# Altium schematic sheet [06] - eMMC, SPI NOR FLASH.SchDoc
size 513 x 386 mm
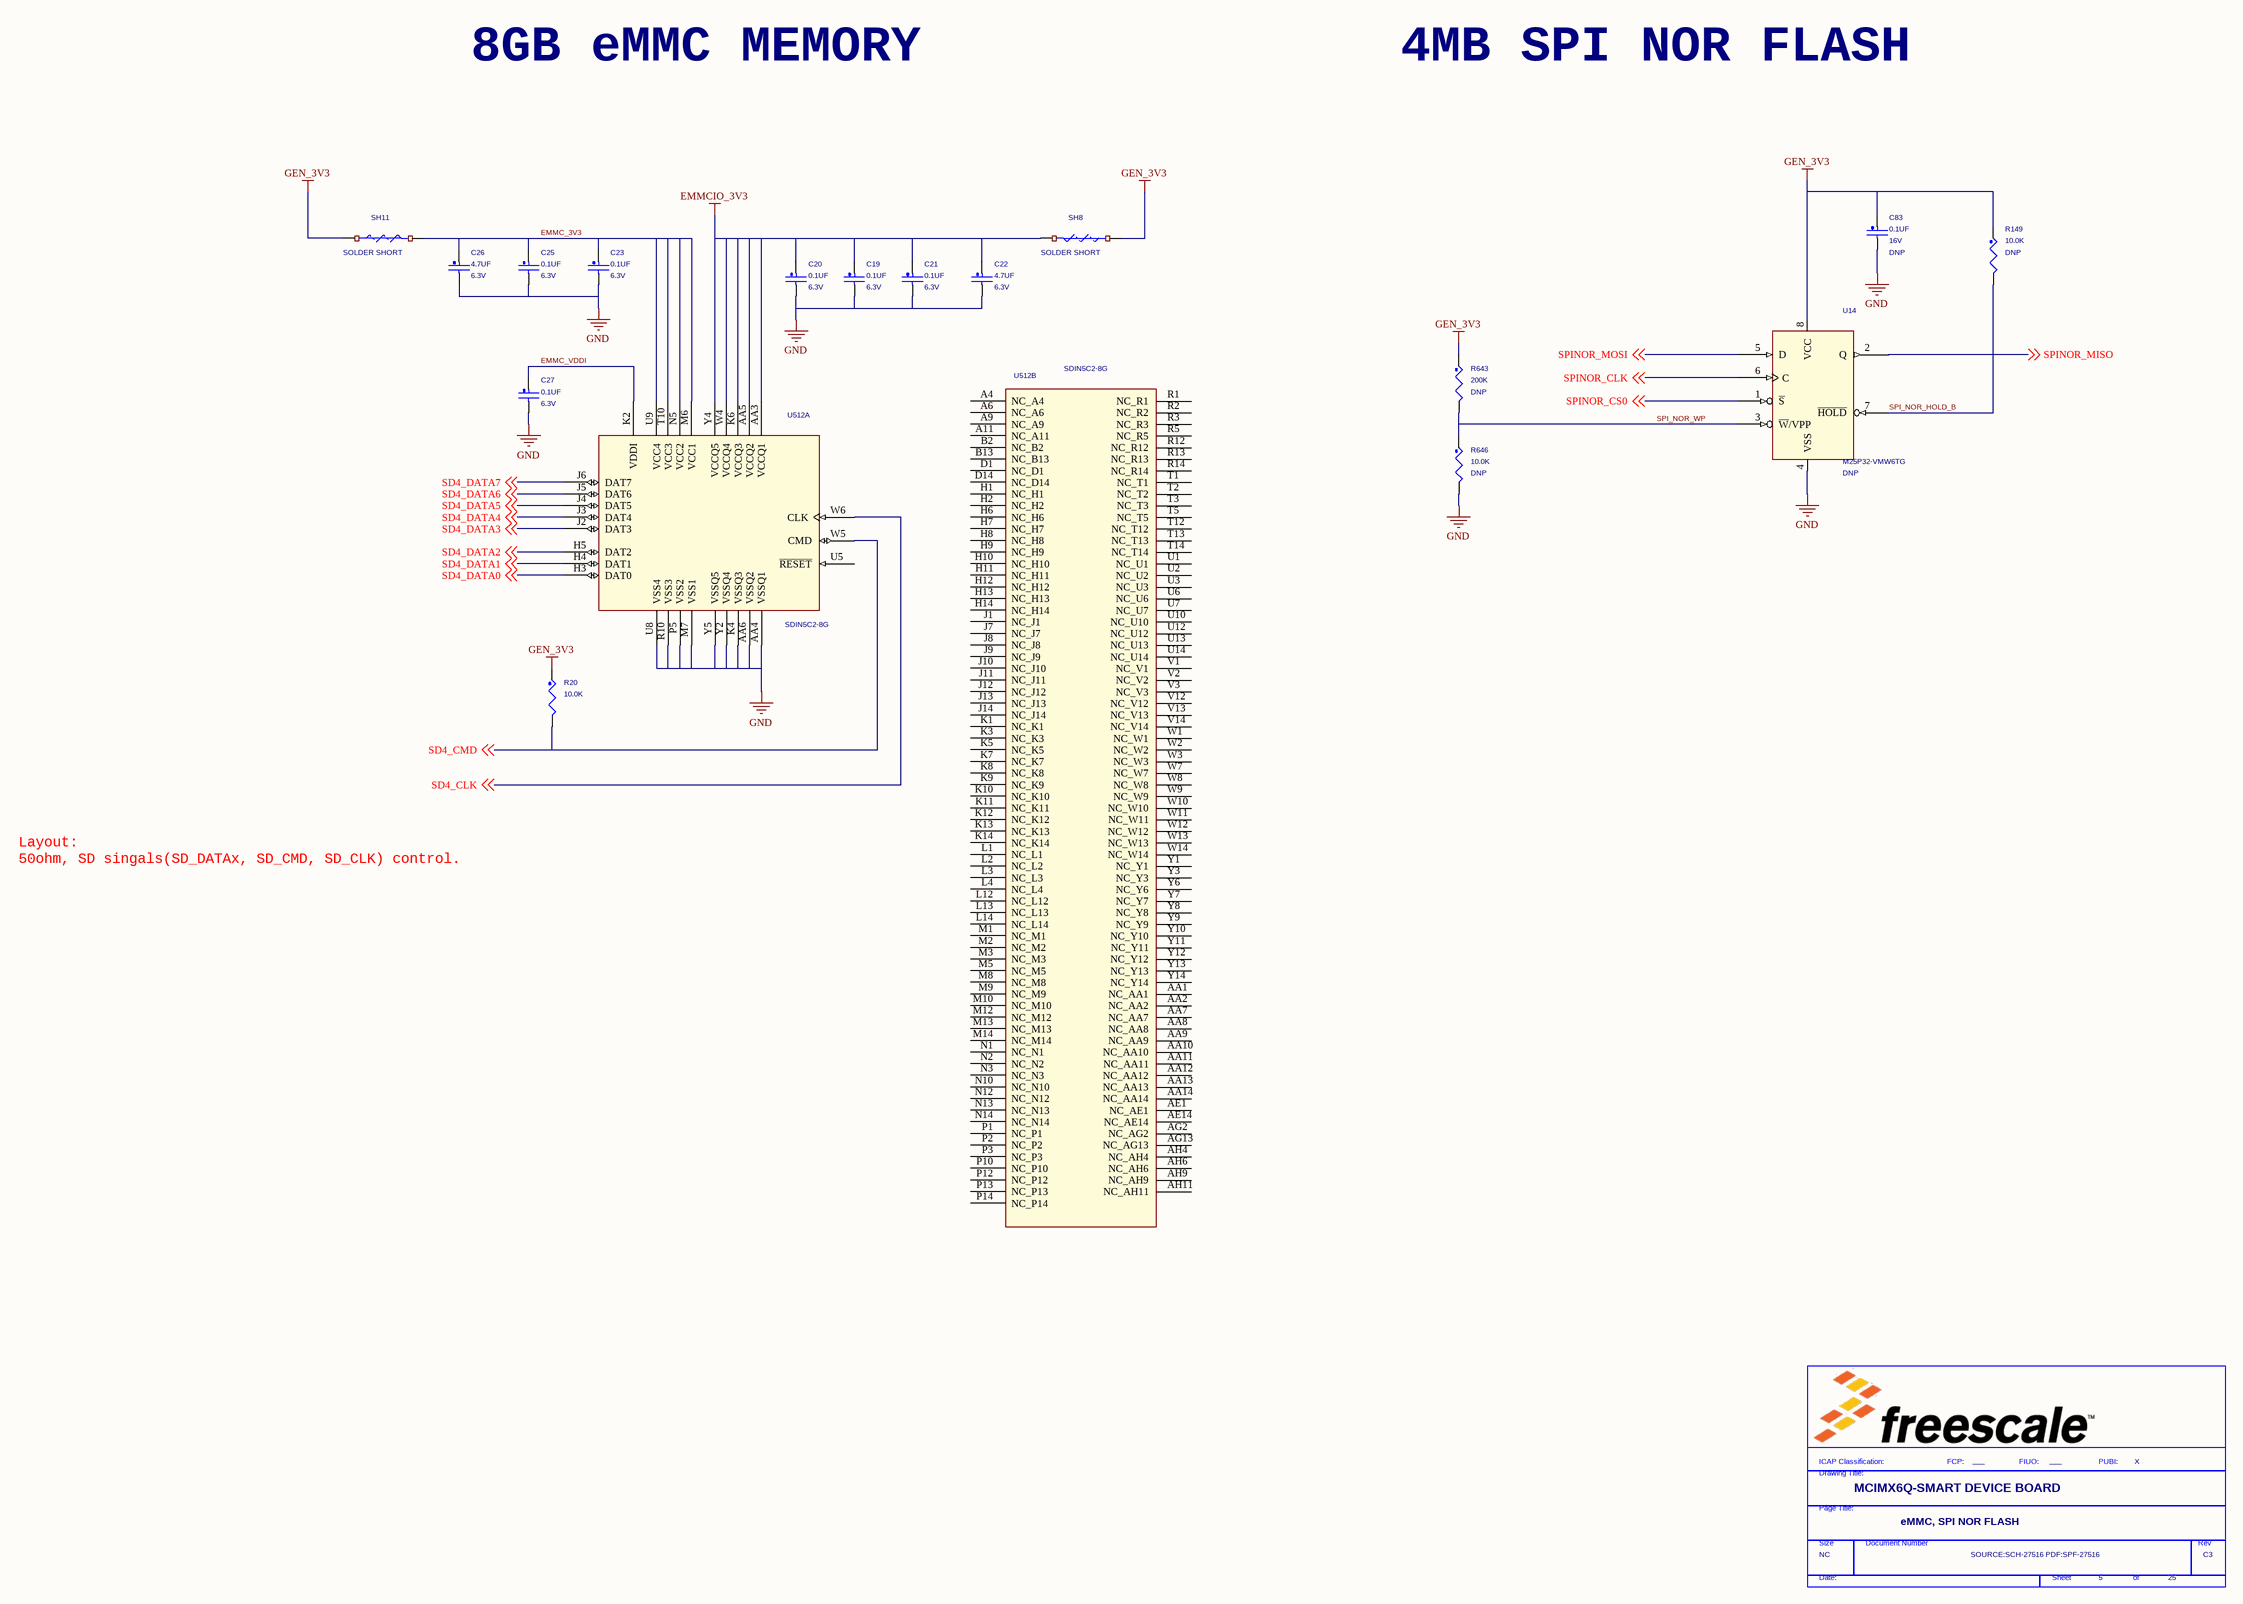
[diagram p0: [06] - eMMC, SPI NOR FLASH.SchDoc]

## Parts
*  FIUO: ___  PUBI: X  Doc: SOURCE:SCH-27516 PDF:SPF-27516  RevCode: C3  Title: MCIMX6Q-SMART DEVICE BOARD  Page Size: NC  Page Number: 5  Page Count: 25  PageTitle: eMMC, SPI NOR FLASH  (hidden comment: TitleBlock_FS)  (graphical)
C19  0.1UF  WVDC: 6.3V  [0201_CC]
C20  0.1UF  WVDC: 6.3V  [0201_CC]
C21  0.1UF  WVDC: 6.3V  [0201_CC]
C22  4.7UF  WVDC: 6.3V  [0603_CC]
C23  0.1UF  WVDC: 6.3V  [0201_CC]
C25  0.1UF  WVDC: 6.3V  [0201_CC]
C26  4.7UF  WVDC: 6.3V  [0603_CC]
C27  0.1UF  WVDC: 6.3V  [0201_CC]
C83  0.1UF  WVDC: 16V  ASSY_OPT: DNP  [0402_CC]
R20  10.0K  [0402_CC]
R149  10.0K  ASSY_OPT: DNP  [0402_CC]
R643  200K  ASSY_OPT: DNP  [0603_CC]
R646  10.0K  ASSY_OPT: DNP  [0402_CC]
SH8  SOLDER SHORT  [SH0805_40]
SH11  SOLDER SHORT  [SH0805_40]
U14  M25P32-VMW6TG  ASSY_OPT: DNP  [SO8WST]
U512  SDIN5C2-8G  [bga169_0p5_12x16]  (parts A,B of 2)

## Nets
EMMCIO_3V3: C19.1 C20.1 C21.1 C22.1 SH8.2 U512.AA3(VCCQ1) U512.AA5(VCCQ2) U512.K6(VCCQ3) U512.W4(VCCQ4) U512.Y4(VCCQ5)
GEN_3V3: C83.1 R20.1 R149.1 R643.1 SH8.1 SH11.1 U14.8(VCC)
GND: C19.2 C20.2 C21.2 C22.2 C23.2 C25.2 C26.2 C27.2 C83.2 R646.2 U14.4(VSS) U512.AA4(VSSQ1) U512.AA6(VSSQ2) U512.K4(VSSQ3) U512.M7(VSS1) U512.P5(VSS2) U512.R10(VSS3) U512.U8(VSS4) U512.Y2(VSSQ4) U512.Y5(VSSQ5)
EMMC_3V3: C23.1 C25.1 C26.1 SH11.2 U512.M6(VCC1) U512.N5(VCC2) U512.T10(VCC3) U512.U9(VCC4)
EMMC_VDDI: C27.1 U512.K2(VDDI)
SD4_CLK: U512.W6(CLK) ; off-sheet SD4_CLK
SD4_CMD: R20.2 U512.W5(CMD) ; off-sheet SD4_CMD
SD4_DATA0: U512.H3(DAT0) ; off-sheet SD4_DATA0
SD4_DATA1: U512.H4(DAT1) ; off-sheet SD4_DATA1
SD4_DATA2: U512.H5(DAT2) ; off-sheet SD4_DATA2
SD4_DATA3: U512.J2(DAT3) ; off-sheet SD4_DATA3
SD4_DATA4: U512.J3(DAT4) ; off-sheet SD4_DATA4
SD4_DATA5: U512.J4(DAT5) ; off-sheet SD4_DATA5
SD4_DATA6: U512.J5(DAT6) ; off-sheet SD4_DATA6
SD4_DATA7: U512.J6(DAT7) ; off-sheet SD4_DATA7
SPI_NOR_HOLD_B: R149.2 U14.7(~{HOLD})
SPI_NOR_WP: R643.2 R646.1 U14.3(~{W}/VPP)
SPINOR_CLK: U14.6(C) ; off-sheet SPINOR_CLK
SPINOR_CS0: U14.1(~{S}) ; off-sheet SPINOR_CS0
SPINOR_MISO: U14.2(Q) ; off-sheet SPINOR_MISO
SPINOR_MOSI: U14.5(D) ; off-sheet SPINOR_MOSI

Not connected (* = marked no-connect by the designer): U512 A4(NC_A4) A6(NC_A6) A9(NC_A9) A11(NC_A11) AA1(NC_AA1) AA2(NC_AA2) AA7(NC_AA7) AA8(NC_AA8) AA9(NC_AA9) AA10(NC_AA10) AA11(NC_AA11) AA12(NC_AA12) AA13(NC_AA13) AA14(NC_AA14) AE1(NC_AE1) AE14(NC_AE14) AG2(NC_AG2) AG13(NC_AG13) AH4(NC_AH4) AH6(NC_AH6) AH9(NC_AH9) AH11(NC_AH11) B2(NC_B2) B13(NC_B13) D1(NC_D1) D14(NC_D14) H1(NC_H1) H2(NC_H2) H6(NC_H6) H7(NC_H7) H8(NC_H8) H9(NC_H9) H10(NC_H10) H11(NC_H11) H12(NC_H12) H13(NC_H13) H14(NC_H14) J1(NC_J1) J7(NC_J7) J8(NC_J8) J9(NC_J9) J10(NC_J10) J11(NC_J11) J12(NC_J12) J13(NC_J13) J14(NC_J14) K1(NC_K1) K3(NC_K3) K5(NC_K5) K7(NC_K7) K8(NC_K8) K9(NC_K9) K10(NC_K10) K11(NC_K11) K12(NC_K12) K13(NC_K13) K14(NC_K14) L1(NC_L1) L2(NC_L2) L3(NC_L3) L4(NC_L4) L12(NC_L12) L13(NC_L13) L14(NC_L14) M1(NC_M1) M2(NC_M2) M3(NC_M3) M5(NC_M5) M8(NC_M8) M9(NC_M9) M10(NC_M10) M12(NC_M12) M13(NC_M13) M14(NC_M14) N1(NC_N1) N2(NC_N2) N3(NC_N3) N10(NC_N10) N12(NC_N12) N13(NC_N13) N14(NC_N14) P1(NC_P1) P2(NC_P2) P3(NC_P3) P10(NC_P10) P12(NC_P12) P13(NC_P13) P14(NC_P14) R1(NC_R1) R2(NC_R2) R3(NC_R3) R5(NC_R5) R12(NC_R12) R13(NC_R13) R14(NC_R14) T1(NC_T1) T2(NC_T2) T3(NC_T3) T5(NC_T5) T12(NC_T12) T13(NC_T13) T14(NC_T14) U1(NC_U1) U2(NC_U2) U3(NC_U3) U5(~{RESET}) U6(NC_U6) U7(NC_U7) U10(NC_U10) U12(NC_U12) U13(NC_U13) U14(NC_U14) V1(NC_V1) V2(NC_V2) V3(NC_V3) V12(NC_V12) V13(NC_V13) V14(NC_V14) W1(NC_W1) W2(NC_W2) W3(NC_W3) W7(NC_W7) W8(NC_W8) W9(NC_W9) W10(NC_W10) W11(NC_W11) W12(NC_W12) W13(NC_W13) W14(NC_W14) Y1(NC_Y1) Y3(NC_Y3) Y6(NC_Y6) Y7(NC_Y7) Y8(NC_Y8) Y9(NC_Y9) Y10(NC_Y10) Y11(NC_Y11) Y12(NC_Y12) Y13(NC_Y13) Y14(NC_Y14)

## Notes on the sheet
- 8GB eMMC MEMORY
- 4MB SPI NOR FLASH
- Layout:
  50ohm, SD singals(SD_DATAx, SD_CMD, SD_CLK) control.
- (in symbol TitleBlock_FS) ICAP Classification:; FCP:; FIUO:; PUBI:; Drawing Title:; Page Title:; Size; Document Number; Rev; Date:; Sheet; of

## Library data of the parts
* = TitleBlock_FS: OrgName: Freescale Semiconductor; OrgAddr1: 6501 William Cannon Drive West; OrgAddr2: Austin, TX 78735-8598; FCP: ___; Page Create Date: March  8, 1995
C19-C21 C25 = CAP_NP: CAP CER 0.1UF 6.3V 10% X5R 0201; CLASS: DISCRETE; FPLIST: CC0201,CC0201_HD,CC0201_3PIN,0201_CC; CAD_APPROVED: Yes; MFG_PN01: GRM033R60J104KE19D; MFG_NAME01: MURATA; AGILE_PN: 150-75429; SIGNAL_MODEL: DEFAULT_CAPACITOR_100000pF_2_1; VOLTAGE: 6.3V; HEIGHT: 0.33MM; ROHS: Yes; Tolerance: 10%
C22 = CAP_NP: CAP CER 4.7UF 6.3V 10% X5R 0603; CLASS: DISCRETE; AGILE_PN: 150-75487; MFG_NAME01: VENKEL COMPANY; MFG_PN01: C0603X5R6R3-475KNP; CAD_APPROVED: Yes; FPLIST: CC0603_OV,CC0603,0603_CC; SIGNAL_MODEL: DEFAULT_CAPACITOR_4.7e+06pF_2_1; VOLTAGE: 6.3V; Tolerance: 10%; ROHS: Yes; HEIGHT: 1.016MM
C23 C27 = CAP_NP: CAP CER 0.1UF 6.3V 10% X5R 0201; CLASS: DISCRETE; AGILE_PN: 150-75429; MFG_NAME01: MURATA; MFG_PN01: GRM033R60J104KE19D; CAD_APPROVED: Yes; FPLIST: CC0201,CC0201_HD,CC0201_3PIN,0201_CC; SIGNAL_MODEL: DEFAULT_CAPACITOR_100000pF_2_1; VOLTAGE: 6.3V; Tolerance: 10%; ROHS: Yes; HEIGHT: 0.33MM
C26 = CAP_NP: CAP CER 4.7UF 6.3V 10% X5R 0603; CLASS: DISCRETE; FPLIST: CC0603_OV,CC0603,0603_CC; CAD_APPROVED: Yes; MFG_PN01: C0603X5R6R3-475KNP; MFG_NAME01: VENKEL COMPANY; AGILE_PN: 150-75487; SIGNAL_MODEL: DEFAULT_CAPACITOR_4.7e+06pF_2_1; VOLTAGE: 6.3V; HEIGHT: 1.016MM; ROHS: Yes; Tolerance: 10%
C83 = CAP_NP: CAP CER 0.1UF 16V 10% X7R 0402; CLASS: DISCRETE; FPLIST: CC0402_25,CC0402_HD,0402_CC; CAD_APPROVED: Yes; MFG_PN01: C0402C104K4RAC; MFG_NAME01: KEMET; AGILE_PN: 150-75182; SIGNAL_MODEL: DEFAULT_CAPACITOR_100000pF_2_1; VOLTAGE: 16V; HEIGHT: 0.635MM; ROHS: Yes; Tolerance: 10%
R20 R149 = RES: RES MF 10.0K 1/16W 1% 0402; CLASS: DISCRETE; FPLIST: RC0402_25,RC0402_HD,0402_CC; CAD_APPROVED: Yes; MFG_PN01: CRCW040210K0FKED; MFG_NAME01: VISHAY INTERTECHNOLOGY; AGILE_PN: 470-75416; SIGNAL_MODEL: DEFAULT_RESISTOR_10000OHM_2_1; ROHS: Yes; Tolerance: 1%
R643 = RES: RES MF 200K 1/10W 1% 0603; CLASS: DISCRETE; FPLIST: RC0603_OV,RC0603,0603_CC; CAD_APPROVED: Yes; MFG_PN01: RK73H1JTTD2003F; MFG_NAME01: KOA SPEER; AGILE_PN: 470-76381; ROHS: Yes; Tolerance: 1%
R646 = RES: RES MF 10.0K 1/16W 1% 0402; CLASS: DISCRETE; AGILE_PN: 470-75416; MFG_NAME01: VISHAY INTERTECHNOLOGY; MFG_PN01: CRCW040210K0FKED; CAD_APPROVED: Yes; FPLIST: RC0402_25,RC0402_HD,0402_CC; SIGNAL_MODEL: DEFAULT_RESISTOR_10000OHM_2_1; Tolerance: 1%; ROHS: Yes
SH8 SH11 = RES_SHORT-2: SOLDER SHORT 0805  SMT NO PART TO ORDER; CLASS: DISCRETE; FPLIST: SH0805,SH0805CUST,SH0805_40; CAD_APPROVED: Yes; ASSY_OPT: DNP; MFG_PN01: SOLDER_SHORT_0805; MFG_NAME01: NOTACOMPONENT; AGILE_PN: 470-80202; ROHS: Yes
U14 = M25P32: IC MEM SERIAL FLASH 32MBIT 2.7-3.6V SO8W; AGILE_PN: 334-77338; MFG_NAME01: NUMONYX; CAD_APPROVED: Yes; CLASS: IC; MFG_PN01: M25P32-VMW6TG; ROHS: Yes; HEIGHT: 2.5MM
U512 = SDIN5C2_TFBGA_169P: IC INAND MEM FLASH 8GB 2.7-3.6V TFBGA169; CAD_APPROVED: Yes; MFG_NAME01: SANDISK CORPORATION; AGILE_PN: 342-00495; CLASS: IC; HEIGHT: 1.2MM; ROHS: Yes; MFG_PN01: SDIN5C2-8G